# EAGLE design axios_sensor_rev1 (EAGLE 9.5.1)
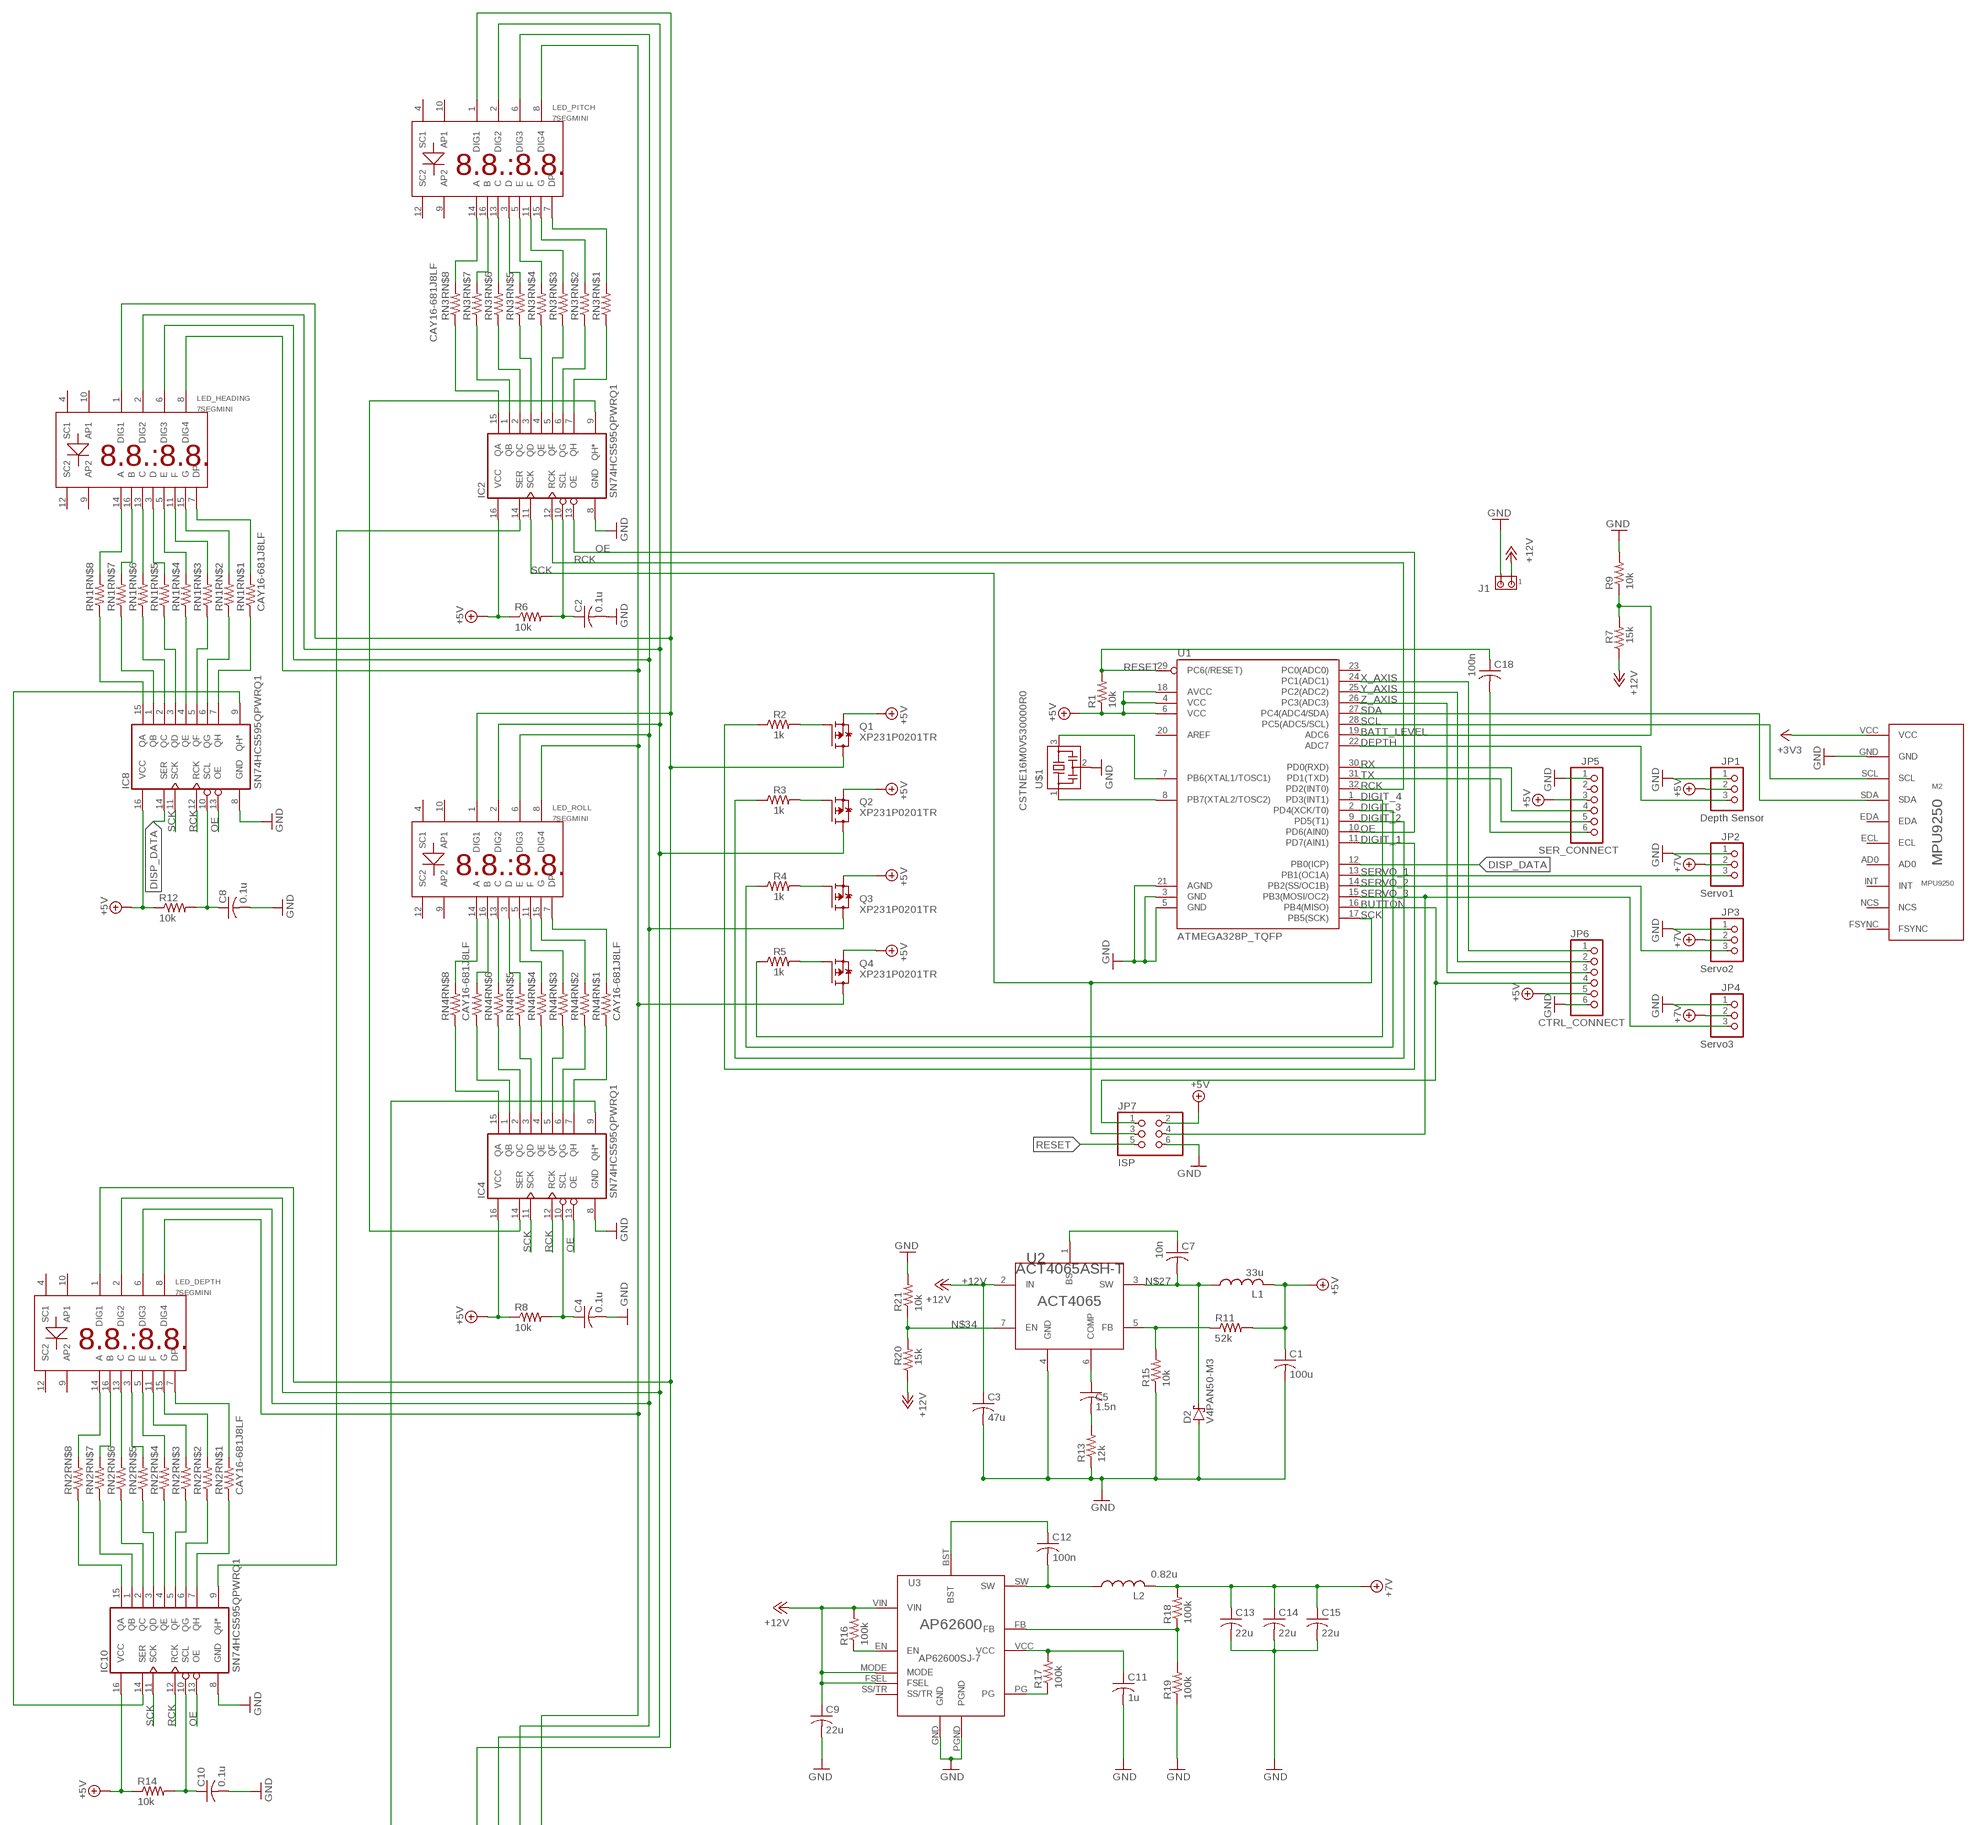
[diagram p0: schematic, sheet 1, part 1 of 2]
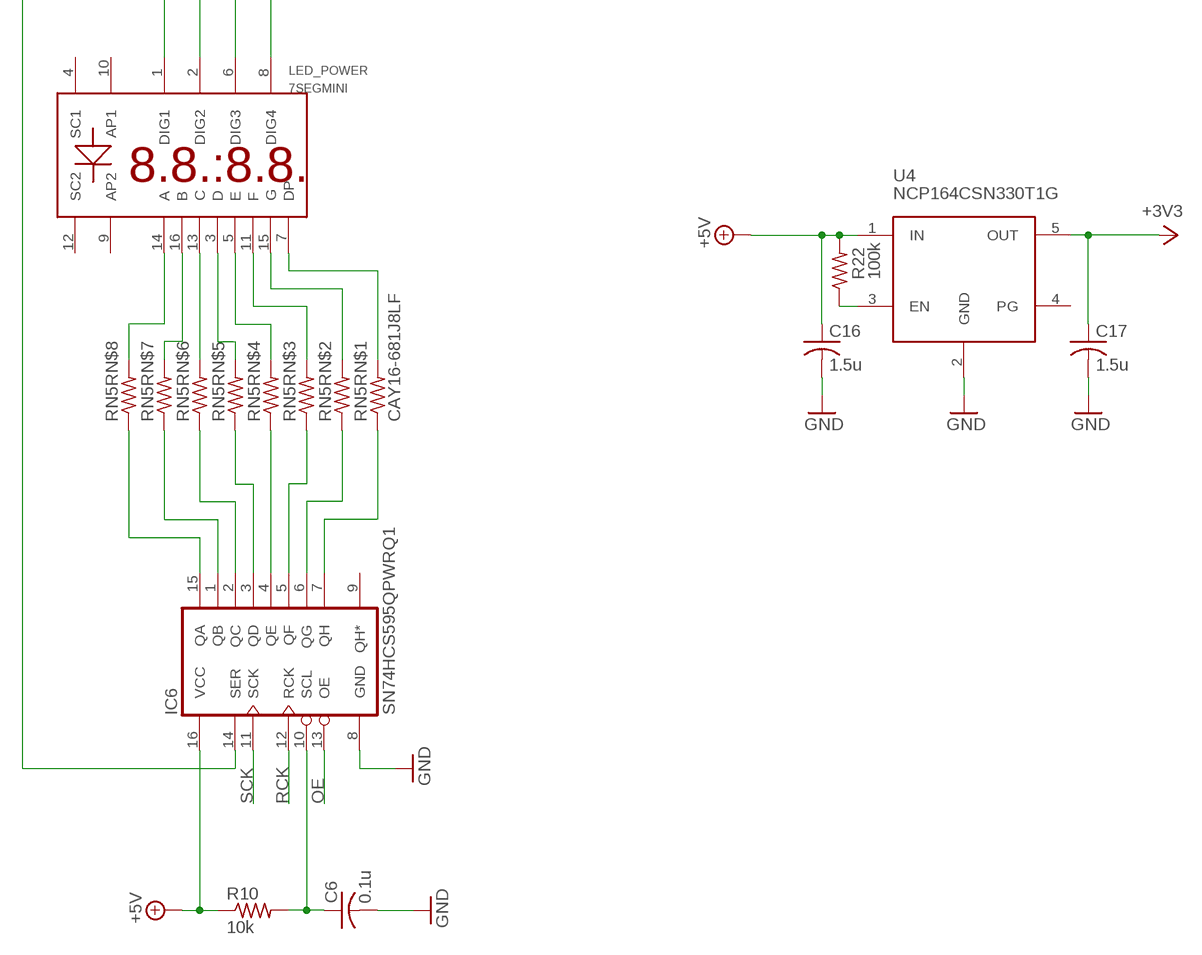
[diagram p1: schematic, sheet 1, part 2 of 2]

## Parts
C1  100u  C-USC0603  [C0603]
C2  0.1u  C-USC0603  [C0603]
C3  47u  C-USC0603  [C0603]
C4  0.1u  C-USC0603  [C0603]
C5  1.5n  C-USC0603  [C0603]
C6  0.1u  C-USC0603  [C0603]
C7  10n  C-USC0603  [C0603]
C8  0.1u  C-USC0603  [C0603]
C9  22u  C-USC0603  [C0603]
C10  0.1u  C-USC0603  [C0603]
C11  1u  C-USC0603  [C0603]
C12  100n  C-USC0603  [C0603]
C13  22u  C-USC0603  [C0603]
C14  22u  C-USC0603  [C0603]
C15  22u  C-USC0603  [C0603]
C16  1.5u  C-USC0603  [C0603]
C17  1.5u  C-USC0603  [C0603]
C18  100n  C-USC0603  [C0603]
D2  V4PAN50-M3  [SMPA]
IC2  SN74HCS595QPWRQ1  [TSSOP16]
IC4  SN74HCS595QPWRQ1  [TSSOP16]
IC6  SN74HCS595QPWRQ1  [TSSOP16]
IC8  SN74HCS595QPWRQ1  [TSSOP16]
IC10  SN74HCS595QPWRQ1  [TSSOP16]
J1  MTA02-156  [1X2MTA]
JP1  Depth Sensor  PINHD-1X3  [1X03]
JP2  Servo1  PINHD-1X3  [1X03]
JP3  Servo2  PINHD-1X3  [1X03]
JP4  Servo3  PINHD-1X3  [1X03]
JP5  SER_CONNECT  PINHD-1X6  [1X06]
JP6  CTRL_CONNECT  PINHD-1X6  [1X06]
JP7  ISP  PINHD-2X3  [2X03]
L1  33u  SRN1060-330M  [SRN1060-330M]
L2  0.82u  ECS-MPIL0630-R82MC  [ECS-MPIL0630-R82MC]
LED_DEPTH  7SEGMINI  [7SEGMINI]
LED_HEADING  7SEGMINI  [7SEGMINI]
LED_PITCH  7SEGMINI  [7SEGMINI]
LED_POWER  7SEGMINI  [7SEGMINI]
LED_ROLL  7SEGMINI  [7SEGMINI]
M2  MPU9250  [MPU9250]
Q1  XP231P0201TR  [SOT23]
Q2  XP231P0201TR  [SOT23]
Q3  XP231P0201TR  [SOT23]
Q4  XP231P0201TR  [SOT23]
R1  10k  R-US_R0603  [R0603]
R2  1k  R-US_R0603  [R0603]
R3  1k  R-US_R0603  [R0603]
R4  1k  R-US_R0603  [R0603]
R5  1k  R-US_R0603  [R0603]
R6  10k  R-US_R0603  [R0603]
R7  15k  R-US_R0603  [R0603]
R8  10k  R-US_R0603  [R0603]
R9  10k  R-US_R0603  [R0603]
R10  10k  R-US_R0603  [R0603]
R11  52k  R-US_R0603  [R0603]
R12  10k  R-US_R0603  [R0603]
R13  12k  R-US_R0603  [R0603]
R14  10k  R-US_R0603  [R0603]
R15  10k  R-US_R0603  [R0603]
R16  100k  R-US_R0603  [R0603]
R17  100k  R-US_R0603  [R0603]
R18  100k  R-US_R0603  [R0603]
R19  100k  R-US_R0603  [R0603]
R20  15k  R-US_R0603  [R0603]
R21  10k  R-US_R0603  [R0603]
R22  100k  R-US_R0603  [R0603]
RN1  CAY16-681J8LF  [CAY16-681J8LF]
RN2  CAY16-681J8LF  [CAY16-681J8LF]
RN3  CAY16-681J8LF  [CAY16-681J8LF]
RN4  CAY16-681J8LF  [CAY16-681J8LF]
RN5  CAY16-681J8LF  [CAY16-681J8LF]
U1  ATMEGA328P_TQFP  [TQFP32-08]
U2  ACT4065ASH-T  [SO8]
U3  AP62600SJ-7  [V-QFN2030-12]
U4  NCP164CSN330T1G  [TSOP-5]
U$1  CSTNE16M0V530000R0  [CSTCR6M]

## Nets
+3V3 [Low Power]: C17.1 M2.VCC U4.5(OUT)
+5V [Low Power]: C1.1 C16.1 IC2.16(VCC) IC4.16(VCC) IC6.16(VCC) IC8.16(VCC) IC10.16(VCC) JP1.2 JP5.3 JP6.5 JP7.2 L1.P$2 Q1.2(S) Q2.2(S) Q3.2(S) Q4.2(S) R1.1 R6.1 R8.1 R10.1 R11.2 R12.1 R14.1 R22.2 U1.4(VCC) U1.6(VCC) U1.18(AVCC) U4.1(IN)
+7V [Low Power]: C13.1 C14.1 C15.1 JP2.2 JP3.2 JP4.2 L2.P$2 R18.2
+12V [Low Power]: C3.1 C9.1 J1.1 R7.1 R16.2 R20.1 U2.2(IN) U3.FSEL U3.MODE U3.VIN
BATT_LEVEL [Digital]: R7.2 R9.1 U1.19(ADC6)
BUTTON: JP6.4 JP7.1 U1.16(PB4(MISO))
DEPTH [Analog]: JP1.3 U1.22(ADC7)
DIGIT_1 [Digital]: R2.1 U1.11(PD7(AIN1))
DIGIT_2 [Digital]: R3.1 U1.9(PD5(T1))
DIGIT_3 [Digital]: R4.1 U1.2(PD4(XCK/T0))
DIGIT_4 [Digital]: R5.1 U1.1(PD3(INT1))
DISP_DATA [Digital]: IC8.14(SER) U1.12(PB0(ICP))
EN7V: R16.1 U3.EN
GND [Medium Power]: C1.2 C2.2 C3.2 C4.2 C6.2 C8.2 C9.2 C10.2 C11.2 C13.2 C14.2 C15.2 C16.2 C17.2 D2.A IC2.8(GND) IC4.8(GND) IC6.8(GND) IC8.8(GND) IC10.8(GND) J1.2 JP1.1 JP2.1 JP3.1 JP4.1 JP5.1 JP6.6 JP7.6 M2.GND R9.2 R13.1 R15.1 R19.1 R21.2 U1.3(GND) U1.5(GND) U1.21(AGND) U2.4(GND) U3.GND U3.PGND U4.2(GND) U$1.2
GND1: R17.1 U3.PG
N$1 [Digital]: C18.2 JP5.6
N$5: IC8.9(QH*) IC10.14(SER)
N$7: U1.8(PB7(XTAL2/TOSC2)) U$1.1
N$12: U1.7(PB6(XTAL1/TOSC1)) U$1.3
N$17: C7.1 U2.1(BS)
N$21: Q1.1(G) R2.2
N$23: Q2.1(G) R3.2
N$24: Q3.1(G) R4.2
N$25: Q4.1(G) R5.2
N$27: C7.2 D2.C L1.P$1 U2.3(SW)
N$29: R11.1 R15.2 U2.5(FB)
N$30: R22.1 U4.3(EN)
N$31: C5.2 R13.2
N$34: R20.2 R21.1 U2.7(EN)
N$35: C5.1 U2.6(COMP)
N$36: C11.1 R17.2 U3.VCC
N$37: C12.2 L2.P$1 U3.SW
N$42: R18.1 R19.2 U3.FB
N$45: LED_PITCH.14(A) RN3.9
N$46: LED_PITCH.16(B) RN3.10
N$47: LED_PITCH.13(C) RN3.11
N$48: LED_PITCH.3(D) RN3.12
N$49: LED_PITCH.5(E) RN3.13
N$50: LED_PITCH.11(F) RN3.14
N$51: LED_PITCH.15(G) RN3.15
N$52: LED_PITCH.7(DP) RN3.16
N$53: IC2.15(QA) RN3.8
N$54: IC2.1(QB) RN3.7
N$55: IC2.2(QC) RN3.6
N$56: IC2.3(QD) RN3.5
N$57: IC2.4(QE) RN3.4
N$58: IC2.5(QF) RN3.3
N$59: IC2.6(QG) RN3.2
N$60: IC2.7(QH) RN3.1
N$61: C2.1 IC2.10(SCL) R6.2
N$62: C12.1 U3.BST
N$65: IC2.14(SER) IC10.9(QH*)
N$95: LED_ROLL.14(A) RN4.9
N$96: LED_ROLL.16(B) RN4.10
N$97: LED_ROLL.13(C) RN4.11
N$98: LED_ROLL.3(D) RN4.12
N$99: LED_ROLL.5(E) RN4.13
N$100: LED_ROLL.11(F) RN4.14
N$101: LED_ROLL.15(G) RN4.15
N$102: LED_ROLL.7(DP) RN4.16
N$103: IC4.15(QA) RN4.8
N$104: IC4.1(QB) RN4.7
N$105: IC4.2(QC) RN4.6
N$106: IC4.3(QD) RN4.5
N$107: IC4.4(QE) RN4.4
N$108: IC4.5(QF) RN4.3
N$109: IC4.6(QG) RN4.2
N$110: IC4.7(QH) RN4.1
N$111: C4.1 IC4.10(SCL) R8.2
N$115: IC2.9(QH*) IC4.14(SER)
N$145: LED_POWER.14(A) RN5.9
N$146: LED_POWER.16(B) RN5.10
N$147: LED_POWER.13(C) RN5.11
N$148: LED_POWER.3(D) RN5.12
N$149: LED_POWER.5(E) RN5.13
N$150: LED_POWER.11(F) RN5.14
N$151: LED_POWER.15(G) RN5.15
N$152: LED_POWER.7(DP) RN5.16
N$153: IC6.15(QA) RN5.8
N$154: IC6.1(QB) RN5.7
N$155: IC6.2(QC) RN5.6
N$156: IC6.3(QD) RN5.5
N$157: IC6.4(QE) RN5.4
N$158: IC6.5(QF) RN5.3
N$159: IC6.6(QG) RN5.2
N$160: IC6.7(QH) RN5.1
N$161: C6.1 IC6.10(SCL) R10.2
N$165: IC4.9(QH*) IC6.14(SER)
N$195: LED_HEADING.14(A) RN1.9
N$196: LED_HEADING.16(B) RN1.10
N$197: LED_HEADING.13(C) RN1.11
N$198: LED_HEADING.3(D) RN1.12
N$199: LED_HEADING.5(E) RN1.13
N$200: LED_HEADING.11(F) RN1.14
N$201: LED_HEADING.15(G) RN1.15
N$202: LED_HEADING.7(DP) RN1.16
N$203: IC8.15(QA) RN1.8
N$204: IC8.1(QB) RN1.7
N$205: IC8.2(QC) RN1.6
N$206: IC8.3(QD) RN1.5
N$207: IC8.4(QE) RN1.4
N$208: IC8.5(QF) RN1.3
N$209: IC8.6(QG) RN1.2
N$210: IC8.7(QH) RN1.1
N$211: C8.1 IC8.10(SCL) R12.2
N$241: LED_DEPTH.1(DIG1) LED_HEADING.1(DIG1) LED_PITCH.1(DIG1) LED_POWER.1(DIG1) LED_ROLL.1(DIG1) Q1.3(D)
N$242: LED_DEPTH.2(DIG2) LED_HEADING.2(DIG2) LED_PITCH.2(DIG2) LED_POWER.2(DIG2) LED_ROLL.2(DIG2) Q2.3(D)
N$243: LED_DEPTH.6(DIG3) LED_HEADING.6(DIG3) LED_PITCH.6(DIG3) LED_POWER.6(DIG3) LED_ROLL.6(DIG3) Q3.3(D)
N$244: LED_DEPTH.8(DIG4) LED_HEADING.8(DIG4) LED_PITCH.8(DIG4) LED_POWER.8(DIG4) LED_ROLL.8(DIG4) Q4.3(D)
N$245: LED_DEPTH.14(A) RN2.9
N$246: LED_DEPTH.16(B) RN2.10
N$247: LED_DEPTH.13(C) RN2.11
N$248: LED_DEPTH.3(D) RN2.12
N$249: LED_DEPTH.5(E) RN2.13
N$250: LED_DEPTH.11(F) RN2.14
N$251: LED_DEPTH.15(G) RN2.15
N$252: LED_DEPTH.7(DP) RN2.16
N$253: IC10.15(QA) RN2.8
N$254: IC10.1(QB) RN2.7
N$255: IC10.2(QC) RN2.6
N$256: IC10.3(QD) RN2.5
N$257: IC10.4(QE) RN2.4
N$258: IC10.5(QF) RN2.3
N$259: IC10.6(QG) RN2.2
N$260: IC10.7(QH) RN2.1
N$261: C10.1 IC10.10(SCL) R14.2
OE [Digital]: IC2.13(OE) IC4.13(OE) IC6.13(OE) IC8.13(OE) IC10.13(OE) U1.10(PD6(AIN0))
RCK [Digital]: IC2.12(RCK) IC4.12(RCK) IC6.12(RCK) IC8.12(RCK) IC10.12(RCK) U1.32(PD2(INT0))
RESET [Digital]: C18.1 JP7.5 R1.2 U1.29(PC6(/RESET))
RX: JP5.4 U1.30(PD0(RXD))
SCK [Digital]: IC2.11(SCK) IC4.11(SCK) IC6.11(SCK) IC8.11(SCK) IC10.11(SCK) JP7.3 U1.17(PB5(SCK))
SCL [Digital]: M2.SCL U1.28(PC5(ADC5/SCL))
SDA [Digital]: M2.SDA U1.27(PC4(ADC4/SDA))
SERVO_1 [Medium Power]: JP2.3 U1.13(PB1(OC1A))
SERVO_2 [Medium Power]: JP3.3 U1.14(PB2(SS/OC1B))
SERVO_3 [Medium Power]: JP4.3 JP7.4 U1.15(PB3(MOSI/OC2))
TX: JP5.5 U1.31(PD1(TXD))
X_AXIS [Digital]: JP6.1 U1.24(PC1(ADC1))
Y_AXIS [Digital]: JP6.2 U1.25(PC2(ADC2))
Z_AXIS [Digital]: JP6.3 U1.26(PC3(ADC3))
Unconnected: IC6.9(QH*) JP5.2 LED_DEPTH.4(SC1) LED_DEPTH.9(AP2) LED_DEPTH.10(AP1) LED_DEPTH.12(SC2) LED_HEADING.4(SC1) LED_HEADING.9(AP2) LED_HEADING.10(AP1) LED_HEADING.12(SC2) LED_PITCH.4(SC1) LED_PITCH.9(AP2) LED_PITCH.10(AP1) LED_PITCH.12(SC2) LED_POWER.4(SC1) LED_POWER.9(AP2) LED_POWER.10(AP1) LED_POWER.12(SC2) LED_ROLL.4(SC1) LED_ROLL.9(AP2) LED_ROLL.10(AP1) LED_ROLL.12(SC2) M2.AD0 M2.ECL M2.EDA M2.FSYNC M2.INT M2.NCS U1.20(AREF) U1.23(PC0(ADC0)) U3.SS/TR U4.4(PG)

## Library data of the parts
C1-C18 = rcl:C-US: CAPACITOR, American symbol; SPICEPREFIX: C
D2 = axios_components:V4PAN50-M3
IC2 IC4 IC6 IC8 IC10 = axios_components:SN74HCS595QPWRQ1
J1 = con-amp:MTA02-156: AMP connector
JP1-JP4 = pinhead:PINHD-1X3: PIN HEADER
JP5 JP6 = pinhead:PINHD-1X6: PIN HEADER
JP7 = pinhead:PINHD-2X3: PIN HEADER
L1 = axios_components:SRN1060-330M
L2 = axios_components:ECS-MPIL0630-R82MC
LED_DEPTH LED_HEADING LED_PITCH LED_POWER LED_ROLL = axios_components:7SEGMINI
M2 = diy-modules:MPU9250
Q1-Q4 = axios_components:XP231P0201TR: P-Channel Enhancement mode MOSFET 200 mA
R1-R22 = rcl:R-US_: RESISTOR, American symbol; SPICEPREFIX: R
RN1-RN5 = axios_components:CAY16-681J8LF
U1 = axios_components:ATMEGA328P_TQFP: Popular 328P in QFP Storefront component: ATmega328 - TQFP <https://www.sparkfun.com/products/13448> (COM-13448) Datasheet <http://www.sparkfun.com/datasheets/Components/SMD/ATMega328.pdf> SparkFun Products SparkFun RedBoard - Programmed with Arduino <https://www.sparkfun.com/products/12757> (DEV-12757) Arduino Pro Mini 328 - 5V/16MHz <https://www.sparkfun.com/products/11113> (DEV-11113) Arduino Pro Mini 328 - 3.3V/8MHz <https://www.sparkfun.com/products/11114> (DEV-11114) SparkFun OpenLog <https://www.sparkfun.com/products/13712> (DEV-13712) SparkFun MicroView - OLED Arduino Module <https://www.sparkfun.com/products/12923> (DEV-12923) SparkFun Digital Sandbox <https://www.sparkfun.com/products/12651> (DEV-12651) SparkFun PicoBoard <https://www.sparkfun.com/products/11888> (WIG-11888) Arduino Fio <https://www.sparkfun.com/products/10116> (DEV-10116) LilyPad Arduino 328 Main Board <https://www.sparkfun.com/products/13342> (DEV-13342) SparkFun RedStick <https://www.sparkfun.com/products/13741> (DEV-13741) LilyPad MP3 <https://www.sparkfun.com/products/11013> (DEV-11013) LilyPad Arduino SimpleSnap <https://www.sparkfun.com/products/10941> (DEV-10941) SparkFun Stepoko <https://www.sparkfun.com/products/13899> (ROB-13899) SparkFun Geiger Counter <https://www.sparkfun.com/products/11345> (SEN-11345) SparkFun EL Sequencer <https://www.sparkfun.com/products/12781> (COM-12781) Arduino Pro 328 - 5V/16MHz <https://www.sparkfun.com/products/10915> (DEV-10915) CryptoCape <https://www.sparkfun.com/products/12773> (DEV-12773) SparkFun IR Thermometer Evaluation Board - MLX90614 <https://www.sparkfun.com/products/10740> (SEN-10740) SparkFun RedBot Mainboard <https://www.sparkfun.com/products/12097> (ROB-12097) Arduino Pro 328 - 3.3V/8MHz <https://www.sparkfun.com/products/10914> (DEV-10914) SparkFun Block for Intel® Edison - Arduino <https://www.sparkfun.com/products/13036> (DEV-13036) SparkFun Simon Says - Surface Mount Soldering Kit <https://www.sparkfun.com/products/10935> (KIT-10935) SparkFun 7-Segment Serial Display - Red <https://www.sparkfun.com/products/11441> (COM-11441) SparkFun 7-Segment Serial Display - White <https://www.sparkfun.com/products/11629> (COM-11629) SparkFun 7-Segment Serial Display - Yellow <https://www.sparkfun.com/products/11443> (COM-11443) SparkFun 7-Segment Serial Display - Kelly Green <https://www.sparkfun.com/products/11440> (COM-11440) SparkFun 7-Segment Serial Display - Blue <https://www.sparkfun.com/products/11442> (COM-11442) SparkFun OpenSegment Serial Display - 20mm (Blue) <https://www.sparkfun.com/products/11647> (COM-11647) SparkFun OpenSegment Serial Display - 20mm (Green) <https://www.sparkfun.com/products/11646> (COM-11646) SparkFun OpenSegment Serial Display - 20mm (White) <https://www.sparkfun.com/products/11648> (COM-11648) SparkFun OpenSegment Serial Display - 20mm (Red) <https://www.sparkfun.com/products/11644> (COM-11644) SparkFun OpenSegment Serial Display - 20mm (Yellow) <https://www.sparkfun.com/products/11645> (COM-11645) SparkFun OpenSegment Shield <https://www.sparkfun.com/products/13190> (DEV-13190); PROD_ID: IC-09069
U2 = axios_components:ACT4065ASH-T
U3 = axios_components:AP62600SJ-7
U4 = axios_components:NCP164CSN330T1G
U$1 = axios_components:CSTNE16M0V530000R0

## Net classes
0 default: width 0.203 mm, drill 0.381 mm, clearance 0.203 mm
1 High Power: width 1.016 mm, drill 1.27 mm, clearance 0.203 mm
2 Low Power: width 0.254 mm, drill 0.635 mm, clearance 0.203 mm
3 Analog: width 0.254 mm, drill 0.381 mm, clearance 0.203 mm
4 Digital: width 0.203 mm, drill 0.381 mm, clearance 0.203 mm
5 Medium Power: width 0.381 mm, drill 0.635 mm, clearance 0.203 mm
6 Other: width 0.203 mm, drill 0.381 mm, clearance 0.152 mm

## Board
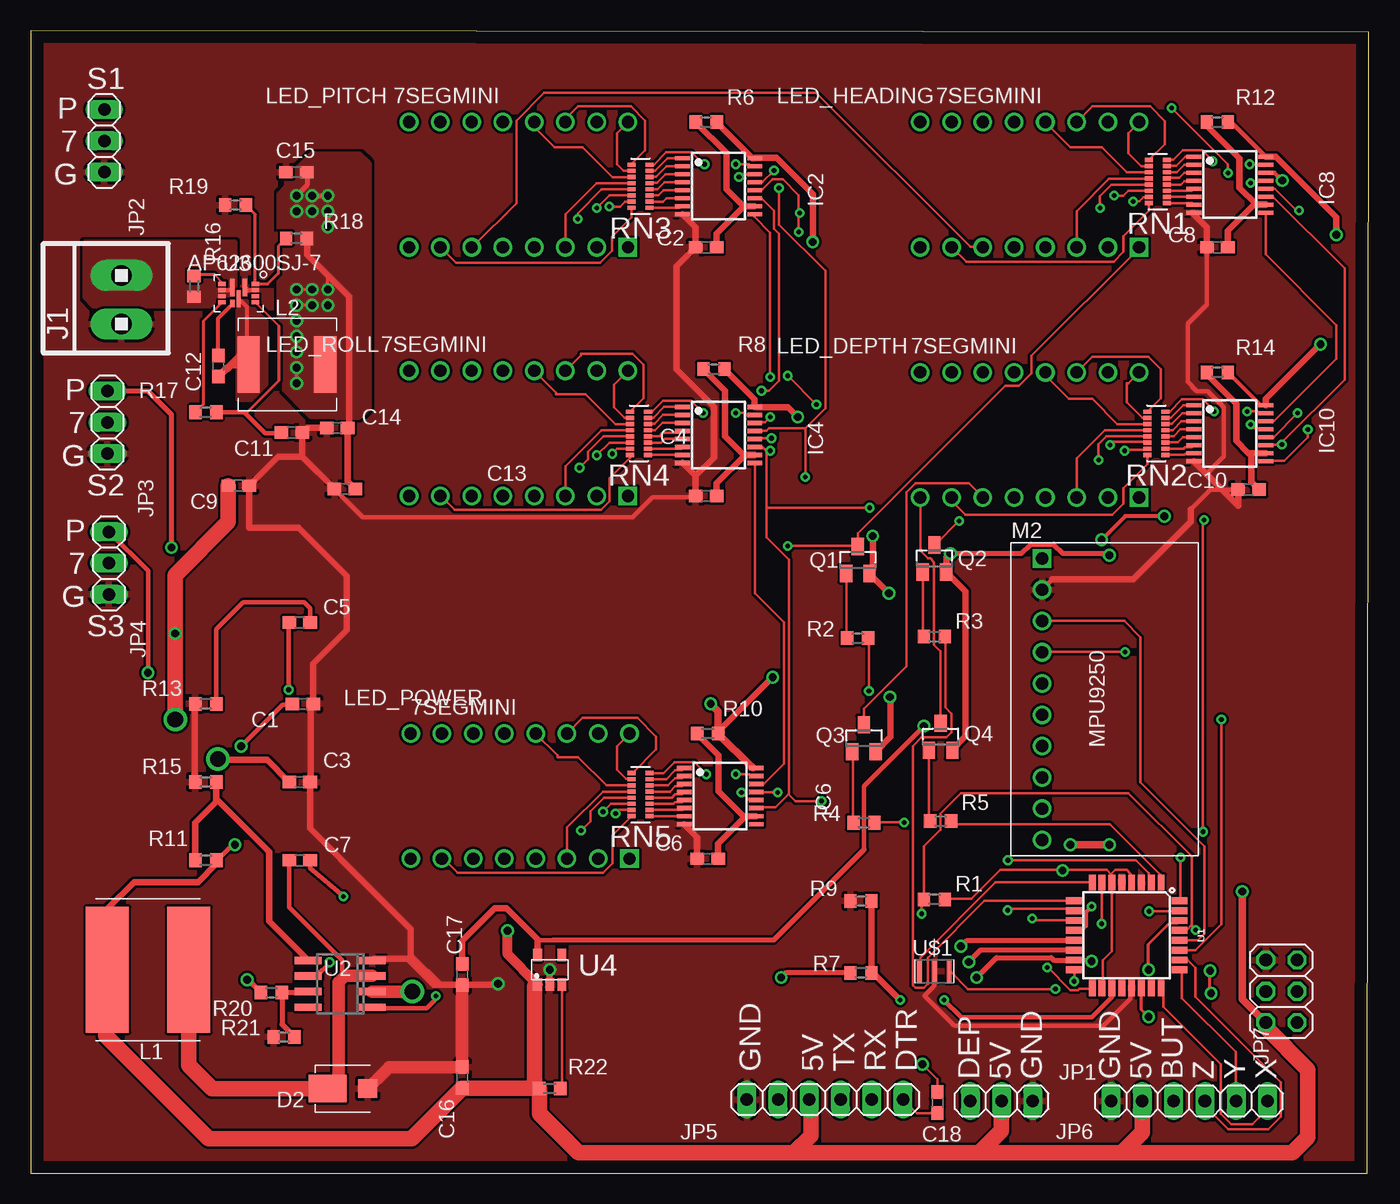
[diagram p2: board, top side]
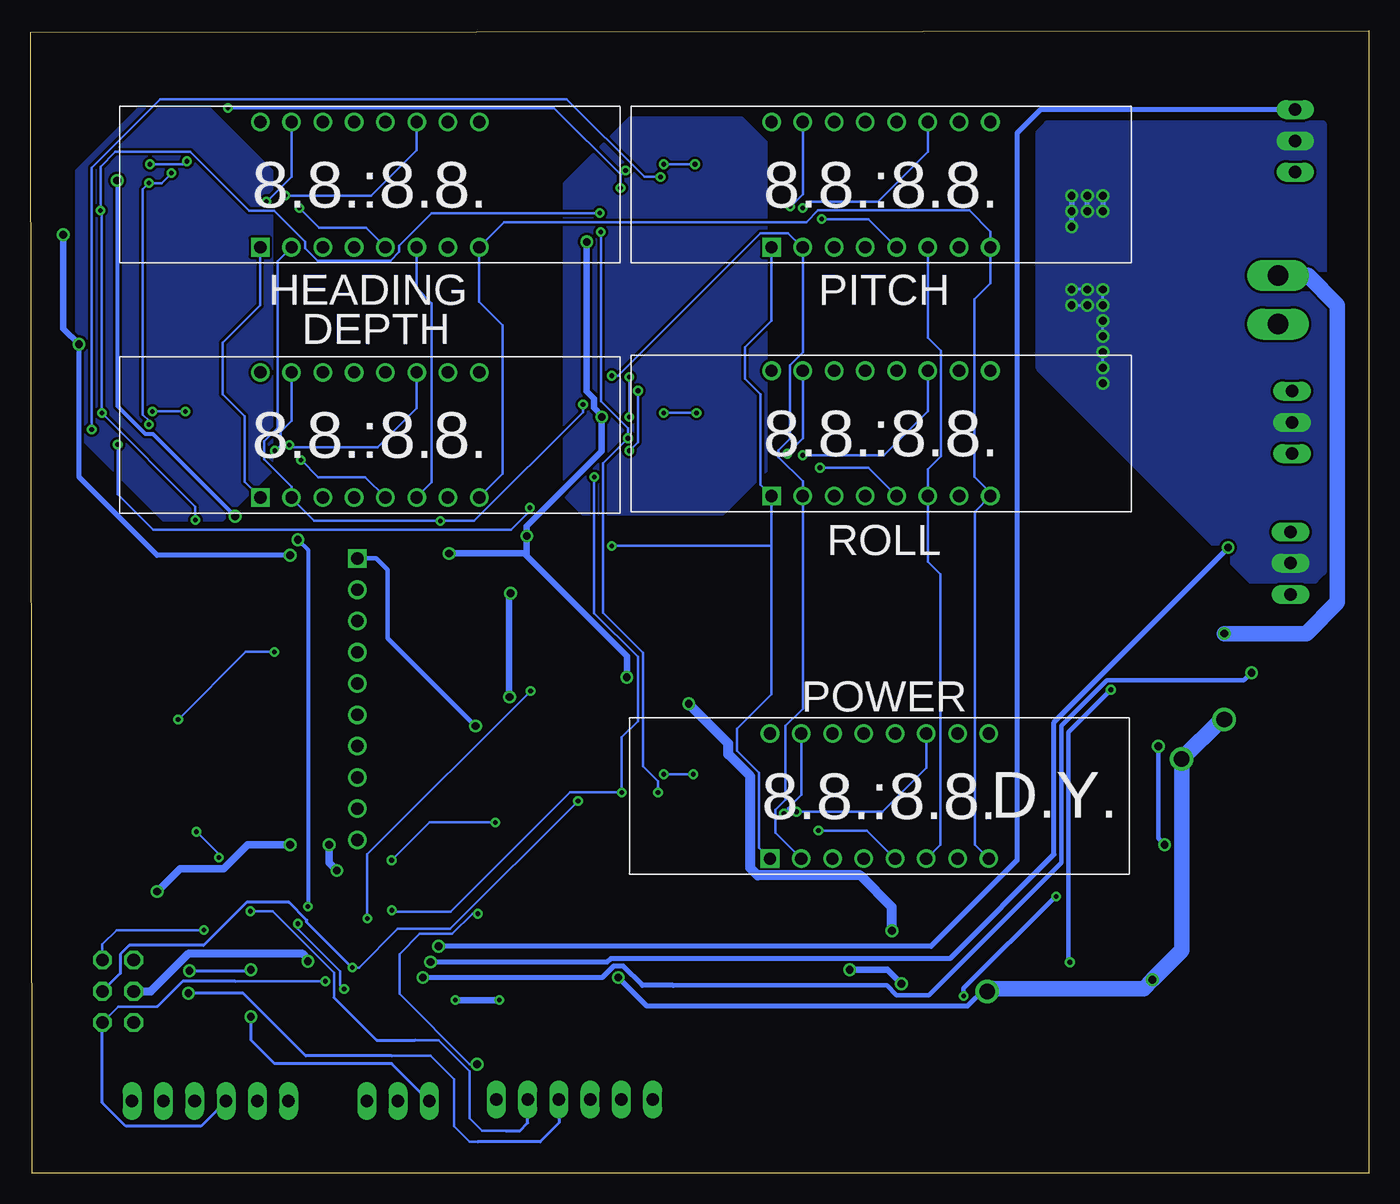
[diagram p3: board, bottom side, seen from below]

Size 108.69 x 92.76 mm. Coordinates in mm from the lower left corner, seen from the top.
Outline: 0,0 108.56,0 108.69,92.63 0,92.76 0,0
Copper layers (1*16): Top 0.035mm / dielectric 1.5mm / Bottom 0.035mm
Design rules "default": minimum track width 6mil, minimum drill 0.35mm, track to track 6mil, track to pad 6mil, pad to pad 6mil, via to via 6mil, smd to smd 6mil, copper to edge 40mil, drill to drill 6mil, minimum pad ring 10mil, minimum via ring 8mil, stop-mask expansion 4mil, vias tented up to drill 0mil, thermal gap 10mil

### Footprints (pad centres in the part's own frame; a part is rotated, then mirrored left to right if it is on the bottom)
C0603 = smd 1.1 x 1: 1 -0.85,0; 2 0.85,0
SMPA = smd 1.524 x 1.524: A 1.702,0 | smd 3.099 x 2.21: C -1.549,0
TSSOP16 = smd 0.35 x 1.2: 1 -2.275,-2.925; 2 -1.625,-2.925; 3 -0.975,-2.925; 4 -0.325,-2.925; 5 0.325,-2.925; 6 0.975,-2.925; 7 1.625,-2.925; 8 2.275,-2.925; 9 2.275,2.925; 10 1.625,2.925; 11 0.975,2.925; 12 0.325,2.925; 13 -0.325,2.925; 14 -0.975,2.925; 15 -1.625,2.925; 16 -2.275,2.925
1X2MTA = drill 1.676 long: 1 1.981,0; 2 -1.981,0
1X03 = drill 1.016 long: 1 -2.54,0; 2 0,0; 3 2.54,0
1X06 = drill 1.016 long: 1 -6.35,0; 2 -3.81,0; 3 -1.27,0; 4 1.27,0; 5 3.81,0; 6 6.35,0
2X03 = drill 1.016 octagon: 1 -2.54,-1.27; 2 -2.54,1.27; 3 0,-1.27; 4 0,1.27; 5 2.54,-1.27; 6 2.54,1.27
SRN1060-330M = smd 3.5 x 10.2: P$1 -3.3,0; P$2 3.3,0
ECS-MPIL0630-R82MC = smd 1.8 x 4.6: P$1 -3.13,0; P$2 3.1,0
7SEGMINI = drill 1 square: 1 -8.89,-5.08 | drill 1: 2 -6.35,-5.08; 3 -3.81,-5.08; 4 -1.27,-5.08; 5 1.27,-5.08; 6 3.81,-5.08; 7 6.35,-5.08; 8 8.89,-5.08; 9 8.89,5.08; 10 6.35,5.08; 11 3.81,5.08; 12 1.27,5.08; 13 -1.27,5.08; 14 -3.81,5.08; 15 -6.35,5.08; 16 -8.89,5.08
MPU9250 = drill 1: AD0 0,-3.81; ECL 0,-1.27; EDA 0,1.27; FSYNC 0,-11.43; GND 0,8.89; INT 0,-6.35; NCS 0,-8.89; SCL 0,6.35; SDA 0,3.81 | drill 1 square: VCC 0,11.43
SOT23 = smd 1 x 1.4: 1 -0.95,-1.1; 2 0.95,-1.1; 3 0,1.1
R0603 = smd 1 x 1.1: 1 -0.85,0; 2 0.85,0
CAY16-681J8LF = smd 0.35 x 0.65: 1 -1.75,-0.725; 2 -1.25,-0.725; 3 -0.75,-0.725; 4 -0.25,-0.725; 5 0.25,-0.725; 6 0.75,-0.725; 7 1.25,-0.725; 8 1.75,-0.725; 9 1.75,0.725; 10 1.25,0.725; 11 0.75,0.725; 12 0.25,0.725; 13 -0.25,0.725; 14 -0.75,0.725; 15 -1.25,0.725; 16 -1.75,0.725
TQFP32-08 = smd 1.27 x 0.559: 1 -4.293,2.8; 2 -4.293,2; 3 -4.293,1.2; 4 -4.293,0.4; 5 -4.293,-0.4; 6 -4.293,-1.2; 7 -4.293,-2; 8 -4.293,-2.8; 17 4.293,-2.8; 18 4.293,-2; 19 4.293,-1.2; 20 4.293,-0.4; 21 4.293,0.4; 22 4.293,1.2; 23 4.293,2; 24 4.293,2.8 | smd 0.559 x 1.27: 9 -2.8,-4.293; 10 -2,-4.293; 11 -1.2,-4.293; 12 -0.4,-4.293; 13 0.4,-4.293; 14 1.2,-4.293; 15 2,-4.293; 16 2.8,-4.293; 25 2.8,4.293; 26 2,4.293; 27 1.2,4.293; 28 0.4,4.293; 29 -0.4,4.293; 30 -1.2,4.293; 31 -2,4.293; 32 -2.8,4.293
SO8 = smd 0.6 x 2.2: 1 -1.905,-2.6; 2 -0.635,-2.6; 3 0.635,-2.6; 4 1.905,-2.6; 5 1.905,2.6; 6 0.635,2.6; 7 -0.635,2.6; 8 -1.905,2.6
V-QFN2030-12 = smd 0.6 x 0.35: BST 0.85,-0.5 | smd 0.35 x 0.6: EN -0.75,-1.35; FB -0.75,1.35; FSEL 0.25,-1.35; GND -0.25,1.35; MODE -0.25,-1.35; PG 0.75,-1.35; SS/TR 0.25,1.35; VCC 0.75,1.35 | smd 1.4 x 0.35: PGND -0.45,0.5; SW 0.45,0; VIN -0.45,-0.5
TSOP-5 = smd 0.7 x 1: 1 -0.99,-1.2; 2 0,-1.2; 3 0.99,-1.2; 4 0.99,1.2; 5 -0.99,1.2
CSTCR6M = smd 0.4 x 1.9: 1 -1.2,0; 2 0,0; 3 1.2,0

### Placement (x,y rotation side)
C1  22.1,38.1 0 top
C2  54.86,75.18 180 top
C3  21.84,31.75 0 top
C4  54.86,54.99 180 top
C5  21.84,44.7 0 top
C6  54.99,25.53 180 top
C7  21.84,25.4 180 top
C8  96.39,75.18 180 top
C9  16.89,55.82 0 top
C10  98.93,55.5 180 top
C11  21.21,60.13 0 top
C12  15.24,65.53 270 top
C13  25.53,55.56 180 top
C14  24.89,60.51 180 top
C15  21.59,81.28 180 top
C16  35.05,7.75 90 top
C17  35.05,16.13 270 top
C18  73.66,5.72 270 top
D2  25.65,6.86 0 top
IC2  55.88,80.14 270 top
IC4  55.88,59.94 270 top
IC6  56.01,30.61 270 top
IC8  97.41,80.26 270 top
IC10  97.41,60.07 270 top
J1  7.37,70.92 90 top
JP1  78.87,5.84 180 top
JP2  5.97,83.82 90 top
JP3  6.22,60.96 90 top
JP4  6.35,49.53 90 top
JP5  64.52,5.97 0 top
JP6  94.11,5.84 180 top
JP7  101.6,14.76 90 top
L1  9.53,16.51 180 top
L2  20.83,65.66 0 top
LED_DEPTH  81.15,59.94 0 bottom
LED_HEADING  81.15,80.26 0 bottom
LED_PITCH  39.62,80.26 0 bottom
LED_POWER  39.75,30.61 0 bottom
LED_ROLL  39.62,60.07 0 bottom
M2  82.17,38.48 0 top
Q1  67.18,49.78 0 top
Q2  73.41,49.91 0 top
Q3  67.69,35.31 0 top
Q4  73.91,35.43 0 top
R1  73.41,22.22 180 top
R2  67.18,43.43 180 top
R3  73.41,43.56 180 top
R4  67.69,28.45 180 top
R5  73.91,28.57 180 top
R6  54.86,85.34 180 top
R7  67.44,16.26 0 top
R8  55.5,65.28 180 top
R9  67.44,22.1 180 top
R10  54.99,35.69 180 top
R11  14.22,25.4 0 top
R12  96.39,85.34 180 top
R13  14.22,38.1 0 top
R14  96.39,65.02 180 top
R15  14.22,31.75 0 top
R16  13.27,72.01 270 top
R17  14.22,61.78 0 top
R18  21.59,75.9 0 top
R19  16.63,78.61 0 top
R20  19.56,14.65 0 top
R21  20.57,11.05 180 top
R22  42.16,6.86 180 top
RN1  91.57,80.52 90 top
RN2  91.44,60.07 90 top
RN3  49.53,80.14 90 top
RN4  49.4,60.07 90 top
RN5  49.53,30.73 90 top
U1  89.03,19.3 270 top
U2  25.15,15.37 90 top
U3  16.89,71.46 270 top
U4  42.16,16.51 0 top
U$1  73.41,16.38 0 top

### Tracks (layer width: path | path; a pad name or v marks a point on that pad's centre or on a via)
+3V3  (via drill 0.64)
  Top 0.381: v72.57,36.3 67.69,31.42 67.69,26.26 | 42.42,18.92 41.23,18.92 41.17,18.98
  Top 0.406: 67.69,26.26 60.35,18.92 42.42,18.92
  Top 0.508: C17.1 35.05,18.88 37.69,21.52 38.63,21.52 41.17,18.98 U4.5
  Bottom 0.381: M2.VCC 80.62,49.91 79.7,49 79.7,43.43 v72.57,36.3
+5V  (via drill 0.64, 0.64 pad 0.38)
  Top 0.203: 87.76,24.26 87.81,24.21 87.81,23.6 | 87.76,24.26 87.4,24.61 83.82,24.61 78.77,24.61 76.43,22.28 74.3,22.28 R1.1 | 87.81,23.6 87.81,18.01 87.1,17.3 87.1,15.06 U1.18 | 87.81,23.6 U1.6 | 87.76,24.26 88.11,24.61 89.03,24.61 89.33,24.31 89.33,23.6 U1.4
  Top 0.254: L1.P$2 6.23,21.46 | 15.07,25.11 R11.2 15.16,25.43 | 74.91,34.37 Q4.2 | 74.4,48.79 Q2.2 74.4,48.9 | 68.4,49 68.2,48.79 Q1.2 | 59.05,62.2 IC4.16 | 21.16,38.02 C1.1 | IC6.16 58.72,32.88 58.67,32.93
  Top 0.305: R14.1 99.92,62.35 IC10.16
  Top 0.381: IC8.16 97.53,85.34 R12.1 | 74.91,34.42 74.91,34.37 | 21.16,38.02 20.45,38.02 v17.09,34.67 | v16.59,26.67 16.41,26.67 15.16,25.43
  Top 0.406: v87.63,50.17 87.48,50.32 83.84,50.32 83.09,51.07 81.25,51.07 80.49,50.32 v74.7,50.32 | R10.1 55.84,35.83 56.05,36.03
  Top 0.508: R6.1 58.65,82.41 IC2.16 58.84,82.45 60.58,82.45 63.53,79.5 v63.53,75.62 | IC4.16 58.8,62.82 R8.1 | 41.27,6.9 R22.2 40.93,7.24 | U4.1 41.07,15.31 40.93,15.17 | 15.07,25.11 13.59,23.62 8.38,23.62 6.23,21.46 | 74.91,34.42 75.95,35.46 75.95,47.24 74.4,48.79 | Q1.2 v69.72,47.09 | 59.05,62.2 61.49,62.2 v62.31,61.39 | 68.4,49 v68.4,51.74 | v60.27,40.26 56.05,36.03 | 74.4,48.9 74.4,50.01 v74.7,50.32 | v69.8,38.66 69.85,38.61 69.85,35.42 Q3.2 | IC8.16 100.35,82.52 101.12,82.52 106.05,77.6 v106.05,76.2 | v104.78,67.31 100.33,62.87 IC10.16
  Top 0.61: 58.67,32.93 58.6,33 58.53,33 R10.1 55.84,37.5 v55.24,38.1 | JP7.2 98.42,14.12 v98.42,22.86 | v87.63,26.67 v84.45,26.67 | v83.82,24.57 83.82,24.61
  Top 0.813: U4.1 38.73,17.75 v38.73,19.68
  Top 1.27: L1.P$2 6.1,16.51 6.1,11.14 14.45,2.79 30.95,2.79 C16.1 41.27,6.9 | 40.93,15.17 40.93,7.24 | R22.2 41.31,4.83 44.49,1.65 61.98,1.65 | 61.98,1.65 63.37,3.05 63.37,5.84 JP5.3 | JP1.2 78.87,3.45 77.07,1.65 | 77.07,1.65 61.98,1.65 | 77.07,1.65 88.65,1.65 | JP6.5 90.3,3.3 88.65,1.65 | JP7.2 100.33,11.82 103.76,8.39 103.76,2.91 102.5,1.65 88.65,1.65
  Bottom 0.254: 68.4,50.32 68.4,50.11 | 62.31,61.49 v62.31,61.39
  Bottom 0.381: v17.09,34.67 17.09,27.18 v16.59,26.67
  Bottom 0.406: v87.63,50.17 98.42,50.17 104.78,56.52 v104.78,67.31
  Bottom 0.508: v62.31,61.39 62.31,58.62 68.4,52.53 v68.4,51.74 68.4,50.32 v74.7,50.32 | v60.27,40.26 60.27,41.99 68.4,50.11 | v63.53,75.62 63.53,63.48 62.94,62.89 62.94,62.13 62.31,61.49 | v69.8,38.66 69.85,38.71 69.85,46.97 v69.72,47.09 | v106.05,76.2 106.05,68.58 v104.78,67.31
  Bottom 0.61: v98.42,22.86 96.56,24.73 93.02,24.73 91.08,26.67 v87.63,26.67 | v84.45,26.67 84.45,25.21 v83.82,24.57
  Bottom 0.813: v38.73,19.68 38.73,21.59 41.31,24.16 49.65,24.16 50.24,24.76 50.24,32.22 52.02,34 52.02,34.87 v55.24,38.1
+7V  (via drill 0.64)
  Top 0.254: L2.P$2 23.93,63.93 | v21.59,64.14 v21.59,65.41 | v21.59,66.67 v21.59,67.95 | v22.86,70.48 v21.59,70.48 | v21.59,71.76 v22.86,71.76 | v24.13,71.76 24.13,72.9 24.07,72.96
  Top 0.406: C15.1 22.44,80.23 v21.59,79.38 | v22.86,79.38 v24.13,79.38 | v24.13,78.11 v24.13,76.84
  Top 0.508: R18.2 22.44,74.59 24.07,72.96 25.87,71.16 25.87,60.64 C14.1 25.74,56.2 C13.1
  Bottom 0.254: v21.59,65.41 v21.59,66.67 | v21.59,67.95 v21.59,69.22 | v24.13,70.48 v22.86,70.48 | v21.59,70.48 v21.59,71.76 | v22.86,71.76 v24.13,71.76
  Bottom 0.406: v21.59,79.38 v21.59,78.11 | v22.86,78.11 v22.86,79.38 | v24.13,78.11 v24.13,79.38 v24.13,76.84
  pour Bottom (no thermals): 3.81,85.09 3.81,48.9 4.44,48.26 9.53,48.26 13.97,52.71 26.67,65.41 26.67,84.45 26.04,85.09
  pour Top (no thermals): 20.95,80.01 20.32,79.38 20.32,64.14 22.86,61.59 26.67,61.59 27.3,62.23 27.3,81.92 26.67,82.55 22.86,82.55 20.95,80.64
+12V  (via drill 0.64, 1.27, 1.27 pad 1.27)
  Top 0.254: v15.19,33.63 15.27,33.55
  Top 0.381: U3.MODE 16.18,71.71 16.25,71.78 16.26,71.78 U3.VIN
  Top 0.406: R20.1 17.67,15.68 v17.59,15.68 | R7.1 61.34,16.26 v60.96,15.88
  Top 0.508: 15.27,33.55 19.19,33.55 C3.1
  Top 1.016: U2.2 v30.99,14.73
  Top 1.27: C9.1 16.04,52.87 11.74,48.57 v11.74,43.82 v11.74,36.83
  Bottom 0.254: 30.58,14.99 v30.99,14.73
  Bottom 0.406: 30.58,14.99 31.18,14.99 32.59,13.58 58.66,13.58 v60.96,15.88
  Bottom 1.27: 30.58,14.99 18.29,14.99 v17.59,15.68 15.16,18.11 15.16,33.6 v15.19,33.63 11.99,36.83 v11.74,36.83 | J1.1 4.95,72.9 2.54,70.48 2.54,46.36 5.08,43.82 v11.74,43.82
  pour Top (rank 2, no thermals): 4.44,75.56 4.44,71.12 5.08,70.48 15.88,70.48 16.51,71.12 16.51,75.56
BATT_LEVEL  (via drill 0.38)
  Top 0.203: 68.3,16.28 R7.2 68.4,16.28 | 68.3,22.07 R9.1 | 87.81,14.96 U1.19
  Top 0.381: 87.81,14.96 87.81,14.27 86.18,12.65 75.59,12.65 v74.19,14.05
  Top 0.508: 68.3,22.07 68.3,16.28 | 68.4,16.28 v70.64,14.05
  Bottom 0.508: v70.64,14.05 v74.19,14.05
BUTTON  (via drill 0.38)
  Top 0.203: v84.76,15.57 84.76,16.48 U1.16
  Bottom 0.203: v84.76,15.57 92.08,15.57 | 98.42,13.51 101.58,13.51 JP7.1
  Bottom 0.254: JP6.4 94.87,3.81 100.97,3.81 102.87,5.72 JP7.1 | 92.08,15.57 96.37,15.57 98.42,13.51
DEPTH  (via drill 0.64)
  Top 0.254: v90.8,12.7 90.23,13.28 U1.22
  Bottom 0.254: JP1.3 79.38,8.89 88.9,8.89 90.8,10.8 v90.8,12.7
DIGIT_1  (via drill 0.38)
  Top 0.203: v68.1,39.14 68.1,43.41 R2.1 | v81.36,20.68 81.48,20.55 84.66,20.55 U1.11
  Bottom 0.203: v68.1,39.14 81.36,25.88 v81.36,20.68
DIGIT_2
  Top 0.203: R3.1 74.3,43.51 74.3,37.82 74.8,37.31 74.8,35.79 74.4,35.38 72.36,35.38 71.65,34.67 71.65,15.27 71.86,15.06 72.57,15.06 72.87,15.37 72.87,17.5 77.48,22.1 U1.9
DIGIT_3  (via drill 0.38)
  Top 0.203: v70.94,28.47 68.61,28.47 R4.1 | U1.2 90.81,23.81 90.81,24.36 89.77,25.4 v79.38,25.4
  Bottom 0.203: v79.38,25.4 76.3,28.47 v70.94,28.47
DIGIT_4
  Top 0.203: R5.1 75.02,28.32 87.66,28.32 91.77,24.21 91.77,23.6 U1.1
DISP_DATA  (via drill 0.38, 0.64)
  Top 0.305: IC8.14 101.02,81.24 v101.66,80.6 | v92.08,53.34 88.91,53.34 v87,51.42 | v86.17,21.63 85.72,21.19 85.72,20.08 85.35,19.7 U1.12
  Bottom 0.305: v92.08,53.34 98.77,60.03 99.4,60.03 101.66,62.3 v101.66,80.6 | v87,51.42 86.17,50.6 v86.17,21.63
EN7V
  Top 0.203: U3.EN 15.57,72.26 14.95,72.93
  Top 0.254: R16.1 13.34,72.93 14.95,72.93
GND  (via drill 0.64)
  Top 0.381: 22.73,31.79 C3.2 | C8.2 95.54,70.52 93.98,68.96 93.98,64.26 94.74,63.5 95.63,63.5 96.93,62.2 96.93,58.19 95.54,56.81 95.54,56.74 | 83.01,48.21 M2.GND | C10.2 95.81,55.5 94.23,53.92 | C4.2 53.77,54.89 50.52,54.89 48.89,53.26 26.95,53.26 24.82,55.4 C13.2 | U$1.2 73.38,16.38 73.38,15.16 72.61,14.39 75.03,11.96 87.15,11.96 89.33,14.15 89.33,14.86 U1.21 | U3.GND 17.59,71.71 U3.PGND
  Top 0.508: IC8.8 94.47,77.98 94.36,77.98 95.54,76.8 C8.2 | IC2.8 54.01,76.8 C2.2 52.45,73.62 52.45,65.28 55.5,62.23 55.5,58.1 54.01,56.61 | IC4.8 54.01,56.61 | 54.01,56.61 C4.2 | IC10.8 95.54,56.74 98.08,54.2 C10.2 | IC6.8 54.14,27.27 C6.2 | 33.23,15.28 30.86,17.65 30.86,19.8 25.21,25.46 25.21,25.49 22.69,28 C3.2 | 33.23,15.28 C17.2 37.88,15.28 v37.97,15.37 | v42.16,16.51 U4.2 | C13.2 22.06,58.18 | 22.06,58.18 C11.2 22.44,60.52 C14.2 | R15.1 13.32,31.8 13.32,38.05 R13.1 | 22.06,58.18 20.11,58.18 C9.2 17.74,52.41 21.76,52.41 25.65,48.51 25.65,44.07 22.95,41.36 C1.2 22.73,37.85 22.73,31.79 | U2.4 27.87,17.4 30.61,17.4 32.73,15.28 33.23,15.28 | 83.01,48.21 89.56,48.21 94.23,52.88 94.23,53.92
  Top 1.016: D2.A 29.09,8.6 C16.2 C17.2
  Bottom 0.508: v37.97,15.37 39.12,16.51 v42.16,16.51
  pour Bottom: 50.93,85.73 60.07,85.73 65.41,80.39 65.41,54.99 63.88,53.47 52.45,53.47 48.89,57.02 48.89,83.69
  pour Bottom: 89.03,81.41 94.11,86.49 99.95,86.49 105.03,81.41 105.03,60.07 97.92,52.96 93.09,52.96 89.03,57.02
  pour Top (rank 6): -0.64,93.34 -0.64,-0.63 109.22,-0.63 109.22,93.34
GND1
  Top 0.254: U3.PG 14.02,69.19 14.02,62.43 R17.1
N$1
  Top 0.203: C18.2 71.97,4.86 JP5.6
N$5
  Top 0.203: IC8.9 100.33,74.6 106.07,68.86 106.07,66.14 101.02,61.09 100.41,61.09 IC10.14
N$7
  Top 0.203: U1.8 78.36,23.6 72.26,17.5 72.26,16.38 U$1.1
N$12  (via drill 0.38)
  Top 0.203: v87,20.24 87,23.6 U1.7 | v83.24,14.93 76.15,14.93 74.7,16.38 U$1.3
  Bottom 0.203: v87,20.24 87,19.84 83.54,16.38 83.54,15.24 v83.24,14.93
N$17  (via drill 0.38)
  Top 0.203: v25.4,22.45 v25.4,22.46
  Top 0.381: v32.92,14.38 32.92,14.15 32.16,13.39 27.82,13.39 U2.1 | v25.4,22.46 22.69,24.76 C7.1
  Bottom 0.381: v25.4,22.45 25.48,22.45 32.92,15.01 v32.92,14.38
N$21
  Top 0.203: R2.2 66.27,43.51 66.27,48.59 Q1.1
N$23
  Top 0.203: R3.2 72.47,43.61 72.47,48.79 Q2.1
N$24
  Top 0.203: R4.2 66.78,28.47 66.78,34.16 Q3.1
N$25
  Top 0.203: R5.2 72.97,28.57 72.97,34.27 Q4.1
N$27
  Top 0.381: C7.2 20.99,21.58 25.3,17.27 25.3,16.41 25.53,16
  Top 1.016: U2.3 25.53,16 25.02,15.49 25.02,7.77 D2.C
  Top 1.27: D2.C 14.73,6.86 12.83,8.77 L1.P$1
N$29
  Top 0.508: R11.1 13.37,28.44 15.07,30.14 15.07,30.4 | 15.07,30.4 19.38,26.1 19.38,20.44 U2.5 | 15.07,30.4 R15.2
N$30
  Top 0.203: U4.3 43.15,7 R22.1
N$31
  Top 0.381: R13.2 15.07,44.16 17.27,46.36 22.22,46.36 22.69,45.89 C5.2
N$34
  Top 0.406: U2.7 22.46,14.65 R20.2 20.41,12.07 R21.1
N$35  (via drill 0.38)
  Top 0.203: U2.6 23.24,16 | 20.95,44.63 C5.1
  Top 0.381: v20.95,39.24 20.95,44.63 | v24.28,17.12 24.28,17.04 23.24,16
  Bottom 0.203: v24.28,17.12 24.38,17.22
  Bottom 0.381: v20.95,39.24 24.38,35.81 24.38,17.22
N$36
  Top 0.203: U3.VCC 20.15,68.81
  Top 0.254: R17.2 17.59,61.78 20.15,64.34 20.15,68.81
  Top 0.381: R17.2 17.34,61.78 19.05,60.07 20.29,60.07 C11.1
N$37
  Top 0.305: U3.SW 17.55,70.35 17.55,66.93
  Top 0.61: C12.2 15.88,65.32 15.95,65.32 16.29,65.66 | 16.29,65.66 L2.P$1 | 16.29,65.66 17.55,66.93
  pour Top (no thermals): 16.89,71.76 16.89,62.87 19.05,62.87 19.05,69.85 18.41,69.85 17.14,71.12 17.14,71.76
N$42
  Top 0.254: R19.2 18.24,77.86 U3.FB 19.25,72.21 20.11,73.06 20.11,75.27 R18.1
N$45
  Top 0.203: LED_PITCH.14 43.43,85.6 44.45,86.61 48.77,86.61 49.91,85.47 49.91,83.06 48.8,81.95 RN3.9
N$46
  Top 0.203: LED_PITCH.16 47.62,84.45 47.62,81.92 48.15,81.39 RN3.10
N$47
  Top 0.203: LED_PITCH.13 40.89,84.96 42.55,83.31 44.83,83.31 47.26,80.89 RN3.11
N$48
  Top 0.203: LED_PITCH.3 43.43,77.85 45.97,80.39 RN3.12
N$49  (via drill 0.38)
  Top 0.203: v44.45,77.47 44.45,77.95 46.39,79.89 RN3.13
  Bottom 0.203: LED_PITCH.5 40.64,77.47 v44.45,77.47
N$50  (via drill 0.38)
  Top 0.203: RN3.14 47,79.39 v45.97,78.36
  Bottom 0.203: LED_PITCH.11 35.81,82.93 39.88,78.87 45.47,78.87 v45.97,78.36
N$51  (via drill 0.38)
  Top 0.203: v46.99,78.49 47.88,78.49 48.28,78.89 RN3.15
  Bottom 0.203: LED_PITCH.15 45.97,79.5 v46.99,78.49
N$52
  Top 0.203: LED_PITCH.7 34.54,73.91 46.23,73.91 47.2,74.89 47.2,76.03 48.8,77.63 RN3.16
N$53  (via drill 0.38)
  Top 0.203: RN3.8 50.61,81.89 51.62,82.89 53.68,82.89 54.66,81.92 v54.74,81.92 | v57.28,81.92 58.35,81.92 58.41,81.85 58.71,81.85 IC2.15
  Bottom 0.203: v54.74,81.92 v57.28,81.92
N$54
  Top 0.203: RN3.7 50.27,81.41 50.71,81.41 51.71,82.41 IC2.1
N$55
  Top 0.203: RN3.6 50.27,80.91 50.78,80.91 51.64,81.76 IC2.2
N$56
  Top 0.203: RN3.5 50.27,80.41 50.86,80.41 51.56,81.11 IC2.3
N$57
  Top 0.203: RN3.4 50.27,79.91 50.93,79.91 51.48,80.46 IC2.4
N$58
  Top 0.203: RN3.3 50.27,79.41 51,79.41 51.41,79.81 IC2.5
N$59
  Top 0.203: RN3.2 51.36,78.89 51.64,79.16 IC2.6
N$60
  Top 0.203: RN3.1 52.69,78.39 52.72,78.42 52.86,78.42 IC2.7
N$61
  Top 0.508: R6.2 56.52,82.84 56.52,79.88 57.89,78.51 IC2.10 57.94,78.51 55.71,76.29 C2.1
N$62
  Top 0.203: U3.BST 16.08,70.3 16.08,70.28
  Top 0.305: C12.1 15.24,69.43 16.08,70.28
N$65  (via drill 0.38)
  Top 0.203: v57.53,80.9 57.73,81.1 58.75,81.1 IC2.14 | v103.73,60.38 103.73,59.74 101.83,57.84 100.41,57.84 IC10.9
  Bottom 0.203: v57.53,80.9 58.85,80.9 65.15,87.2 98.17,87.2 103.73,81.64 v103.73,60.38
N$95
  Top 0.203: LED_ROLL.14 44.7,66.42 44.7,66.55 48.89,66.55 49.78,65.66 49.78,62.93 RN4.9
N$96
  Top 0.203: LED_ROLL.16 47.37,64.01 47.37,62.2 48.25,61.32 RN4.10
N$97
  Top 0.203: LED_ROLL.13 42.67,63.37 42.67,63.25 45.09,63.25 47.51,60.82 RN4.11
N$98
  Top 0.203: LED_ROLL.3 43.43,57.4 46.35,60.32 RN4.12
N$99  (via drill 0.38)
  Top 0.203: v44.58,57.28 45.28,57.98 45.28,58.58 46.51,59.82 RN4.13
  Bottom 0.203: LED_ROLL.5 40.64,57.28 v44.58,57.28
N$100  (via drill 0.38)
  Top 0.203: v45.97,58.29 47,59.32 RN4.14
  Bottom 0.203: LED_ROLL.11 35.81,61.85 39.37,58.29 v45.97,58.29
N$101  (via drill 0.38)
  Top 0.203: v47.24,58.42 47.64,58.82 RN4.15
  Bottom 0.203: LED_ROLL.15 45.97,59.69 v47.24,58.42
N$102
  Top 0.203: LED_ROLL.7 34.42,53.85 46.33,53.85 47.03,54.55 47.03,56.43 48.68,58.08 RN4.16
N$103  (via drill 0.38)
  Top 0.203: RN4.8 50.48,61.82 51.36,62.7 53.63,62.7 v54.61,61.72 | IC4.15 58.77,61.53 58.23,61.53 58.04,61.72 v57.28,61.72
  Bottom 0.203: v57.28,61.72 v54.61,61.72
N$104
  Top 0.203: RN4.7 50.15,61.34 50.58,61.34 51.46,62.22 IC4.1
N$105
  Top 0.203: RN4.6 50.15,60.84 50.65,60.84 51.38,61.57 IC4.2
N$106
  Top 0.203: RN4.5 50.15,60.34 50.73,60.34 51.31,60.92 IC4.3
N$107
  Top 0.203: IC4.4 52.78,60.1 51.34,60.1 51.06,59.82 RN4.4
N$108
  Top 0.203: RN4.3 51.21,59.32 51.51,59.62 IC4.5
N$109
  Top 0.203: RN4.2 52.81,58.82 IC4.6
N$110
  Top 0.203: RN4.1 IC4.7
N$111
  Top 0.508: R8.2 56.39,63.54 56.39,59.82 57.89,58.32 IC4.10 58.79,58.3 58.02,58.3 55.71,56 C4.1
N$115  (via drill 0.38)
  Top 0.203: v60.07,61.39 59.66,60.98 58.85,60.98 IC4.14 | v60.07,64.64 60.07,76.38 58.8,77.64 IC2.9
  Bottom 0.203: v60.07,64.64 v60.07,61.39
N$145
  Top 0.203: LED_POWER.14 44.83,36.96 49.28,36.96 50.8,35.43 50.8,34.42 48.87,32.48 RN5.9
N$146
  Top 0.203: RN5.10 48.78,32 48.35,32 47.62,32.73 47.62,34.67 LED_POWER.16
N$147
  Top 0.203: LED_POWER.13 42.8,33.91 42.8,33.78 44.48,33.78 46.75,31.5 48.78,31.5 RN5.11
N$148
  Top 0.203: LED_POWER.3 43.56,28.07 46.48,30.98 RN5.12
N$149  (via drill 0.38)
  Top 0.203: v44.7,27.81 45.47,28.57 45.47,29.4 46.55,30.48 RN5.13
  Bottom 0.203: LED_POWER.5 40.77,27.81 v44.7,27.81
N$150  (via drill 0.38)
  Top 0.203: v46.48,29.34 47.13,29.98 RN5.14
  Bottom 0.203: LED_POWER.11 35.94,32.89 39.5,29.34 v46.48,29.34
N$151  (via drill 0.38)
  Top 0.203: v47.5,29.21 47.78,29.49 48.79,29.49 RN5.15
  Bottom 0.203: v47.5,29.21 47.18,29.53 47.18,29.63 46.1,30.71 LED_POWER.15
N$152
  Top 0.203: LED_POWER.7 33.53,25.53 34.67,24.38 46.48,24.38 47.24,25.15 47.24,27.42 RN5.16
N$153  (via drill 0.38)
  Top 0.203: RN5.8 51.41,32.48 52.28,33.36 53.94,33.36 54.86,32.43 v54.86,32.39 | v57.28,32.39 58.35,32.39 58.41,32.32 58.84,32.32 IC6.15
  Bottom 0.203: v57.28,32.39 v54.86,32.39
N$154
  Top 0.203: IC6.1 52.91,32.71 52.36,32.71 51.63,31.98 RN5.7
N$155
  Top 0.203: IC6.2 52.91,32.06 52.36,32.06 51.78,31.48 RN5.6
N$156
  Top 0.203: IC6.3 52.91,31.41 52.36,31.41 51.93,30.98 RN5.5
N$157
  Top 0.203: IC6.4 52.91,30.76 52.36,30.76 52.08,30.48 RN5.4
N$158
  Top 0.203: RN5.3 52.23,29.98 52.36,30.11 52.91,30.11 IC6.5
N$159
  Top 0.203: RN5.2 52.93,29.48 IC6.6
N$160
  Top 0.203: RN5.1 IC6.7
N$161
  Top 0.508: R10.2 55.88,33.95 55.88,30.99 57.89,28.98 IC6.10 58.06,28.98 55.84,26.76 C6.1
N$165
  Top 0.203: IC4.9 58.85,57.63 58.85,47.07 61.19,44.73 61.19,33.25 59.56,31.62 58.95,31.62 IC6.14
N$195
  Top 0.203: RN1.9 92.12,83.54 92.12,85.43 90.93,86.61 86.23,86.61 LED_HEADING.14
N$196
  Top 0.203: RN1.10 90.21,81.77 89.15,82.82 89.15,84.45 LED_HEADING.16
N$197
  Top 0.203: RN1.11 89.04,81.27 87,83.31 84.45,83.31 LED_HEADING.13
N$198
  Top 0.203: RN1.12 90.82,80.75 87.6,80.75 84.96,78.11 LED_HEADING.3
N$199  (via drill 0.38)
  Top 0.203: v86.87,78.36 86.87,79.34 87.79,80.27 RN1.13
  Bottom 0.203: v86.87,78.36 85.26,76.75 81.45,76.75 LED_HEADING.5
N$200  (via drill 0.38)
  Top 0.203: RN1.14 89.17,79.77 88.77,79.38 v88.01,79.38
  Bottom 0.203: LED_HEADING.11 77.34,83.06 81.03,79.38 v88.01,79.38
N$201  (via drill 0.38)
  Top 0.203: RN1.15 90.82,79.25 90.39,79.25 90.04,78.9 v89.54,78.9
  Bottom 0.203: LED_HEADING.15 87.5,80.9 89.5,78.9 v89.54,78.9
N$202
  Top 0.203: LED_HEADING.7 75.99,74 87.97,74 88.77,74.8 88.77,76.06 90.84,78.13 RN1.16
N$203  (via drill 0.38)
  Top 0.203: RN1.8 92.32,82.3 92.84,82.3 93.6,83.06 95.17,83.06 96.01,82.22 v96.01,82.17 | v99.02,81.92 99.05,81.89 IC8.15
  Bottom 0.203: v96.01,82.17 96.27,81.92 v99.02,81.92
N$204
  Top 0.203: RN1.7 92.31,81.79 93.05,81.79 93.8,82.54 IC8.1
N$205
  Top 0.203: RN1.6 93.1,81.27 93.72,81.89 IC8.2
N$206
  Top 0.203: RN1.5 92.34,80.81 93.3,80.81 93.72,81.24 IC8.3
N$207
  Top 0.203: RN1.4 93.44,80.27 93.71,80.55 94.44,80.55 IC8.4
N$208
  Top 0.203: IC8.5 94.31,79.77 RN1.3
N$209
  Top 0.203: RN1.2 94.46,79.27 IC8.6
N$210
  Top 0.203: RN1.1 94.36,78.77 IC8.7
N$211
  Top 0.508: R12.2 95.54,85.05 98.17,82.42 98.17,80.03 99.55,78.66 100.32,78.66 IC8.10 99.34,78.64 97.24,76.54 C8.1
N$241  (via drill 0.38)
  Top 0.203: v61.49,50.93 67.18,50.93 | 67.18,50.93 67.18,51.94 79.17,63.93 80.29,63.93 81.3,64.95 81.3,66.37 90.04,75.11 LED_HEADING.1 | 67.18,50.93 Q1.3
  Bottom 0.203: LED_PITCH.1 48.51,69.22 50.67,67.06 50.67,64.52 49.4,63.25 49.4,55.88 LED_ROLL.1 48.51,50.93 | 48.51,50.93 48.51,38.86 51.31,36.07 51.31,34.29 49.53,32.51 49.53,26.42 LED_POWER.1 | LED_HEADING.1 90.04,70.48 93.09,67.44 93.09,63.25 91.31,61.47 91.31,56.13 LED_DEPTH.1 | 48.51,50.93 v61.49,50.93
N$242  (via drill 0.38)
  Top 0.203: v75.41,52.96 73.48,51.03 Q2.3 | v61.49,64.75 v63.83,62.41
  Bottom 0.203: LED_POWER.2 48.2,27.62 48.2,29.5 47.37,30.32 47.37,36.32 45.97,37.72 LED_ROLL.2 45.97,56.16 47.94,58.13 47.94,58.71 47.03,59.62 47.03,65.59 45.97,66.65 LED_PITCH.2 46.05,75.21 47.17,76.33 49.4,76.33 60.98,64.75 v61.49,64.75 | LED_HEADING.2 88.65,74.04 88.65,60.52 89.72,59.44 89.72,57.98 87.5,55.75 LED_DEPTH.2 87.5,54.79 85.67,52.96 v75.41,52.96 72.67,52.96 63.83,61.8 v63.83,62.41
N$243
  Top 0.203: Q3.3 67.69,37.72 71.14,41.17 71.14,55.3 71.86,56.01 76.22,56.01 77.34,54.89 LED_DEPTH.6 | LED_HEADING.6 77.34,75.21 76.33,75.21 63.8,87.73 41.71,87.73 39.45,85.47 39.45,78.77 35.89,75.21 LED_PITCH.6
  Bottom 0.203: LED_PITCH.6 35.81,67.82 34.75,66.76 34.75,58.21 35.81,57.15 LED_ROLL.6 35.81,49.66 34.8,48.64 34.8,26.67 LED_POWER.6 | LED_HEADING.6 77.34,71.88 76.12,70.66 76.12,56.09 LED_DEPTH.6
N$244
  Top 0.203: LED_DEPTH.8 72.26,50.52 72.87,49.91 73.08,49.91 73.38,49.61 73.38,42.9 73.89,42.39 73.89,36.6 Q4.3
  Bottom 0.203: LED_DEPTH.8 70.36,56.77 70.36,68.83 72.26,70.74 LED_HEADING.8 70.23,77.22 45.69,77.22 44.74,78.17 32.45,78.17 30.73,76.45 LED_PITCH.8 30.73,72.26 32.05,70.95 32.05,56.56 30.73,55.25 LED_ROLL.8 32,53.72 32,26.67 LED_POWER.8
N$245
  Top 0.203: LED_DEPTH.14 86.23,66.29 90.8,66.29 91.82,65.28 91.82,62.93 RN2.9
N$246
  Top 0.203: LED_DEPTH.16 89.15,64.14 89.03,64.14 89.03,62.58 90.28,61.32 RN2.10
N$247
  Top 0.203: LED_DEPTH.13 82.42,64.77 84.33,62.87 86.23,62.87 88.28,60.82 RN2.11
N$248
  Top 0.203: LED_DEPTH.3 84.96,58.04 87.25,60.32 RN2.12
N$249  (via drill 0.38)
  Top 0.203: v86.74,57.91 86.74,58.83 86.73,58.84 86.73,59.17 87.39,59.83 87.97,59.83 87.98,59.82 RN2.13
  Bottom 0.203: LED_DEPTH.5 81.53,56.52 85.34,56.52 v86.74,57.91
N$250  (via drill 0.38)
  Top 0.203: v87.68,59.13 87.94,59.4 90.64,59.4 RN2.14
  Bottom 0.203: LED_DEPTH.11 77.34,62.1 80.52,58.93 87.47,58.93 v87.68,59.13
N$251  (via drill 0.38)
  Top 0.203: RN2.15 90.64,58.75 88.94,58.75 v88.85,58.65
  Bottom 0.203: LED_DEPTH.15 87.5,61.09 88.39,60.2 88.39,59.11 v88.85,58.65
N$252
  Top 0.203: RN2.16 90.72,57.57 88.77,55.63 88.77,54.36 87.88,53.47 75.95,53.47 74.8,54.61 LED_DEPTH.7
N$253  (via drill 0.38)
  Top 0.203: RN2.8 92.52,61.82 93.53,62.83 95.21,62.83 96.14,61.9 v96.14,61.85 | IC10.15 100.24,61.79 99.69,61.79 99.62,61.85 v98.81,61.85
  Bottom 0.203: v98.81,61.85 v96.14,61.85
N$254
  Top 0.203: RN2.7 92.19,61.34 92.62,61.34 93.62,62.35 IC10.1
N$255
  Top 0.203: RN2.6 92.19,60.84 92.69,60.84 93.55,61.7 IC10.2
N$256
  Top 0.203: RN2.5 92.19,60.34 92.77,60.34 93.47,61.05 IC10.3
N$257
  Top 0.203: RN2.4 92.19,59.84 92.84,59.84 93.39,60.4 IC10.4
N$258
  Top 0.203: RN2.3 92.19,59.34 93.17,59.34 93.57,59.75 IC10.5
N$259
  Top 0.203: RN2.2 93.65,58.82 93.76,58.93 94.31,58.93 IC10.6
N$260
  Top 0.203: RN2.1 93.73,58.32 93.86,58.45 IC10.7
N$261
  Top 0.508: R14.2 95.54,64.86 97.92,62.48 97.92,59.46 98.93,58.45 IC10.10 99.15,58.45 99.15,56.13 C10.1
OE  (via drill 0.38)
  Top 0.203: v60.68,30.91 58.95,30.91 IC6.13 | v79.35,21.34 79.48,21.46 84.52,21.46 U1.10 | v99.08,60.78 99.39,60.48 100.3,60.48 IC10.13 | v99.08,80.39 99.49,80.39 99.59,80.49 100.3,80.49 IC8.13 | 62.92,60.48 59.97,60.48 59.77,60.27 58.85,60.27 IC4.13 | 62.92,60.48 64.54,62.1 64.54,73.25 60.78,77.01 v60.78,79.98 | v60.38,81.41 59.46,80.49 58.85,80.49 IC2.13 | v97.26,81.2 97.26,81.92 v92.69,86.49 | 62.92,60.48 v62.92,56.52
  Bottom 0.203: v79.35,21.34 79.22,21.21 74.6,21.21 64.9,30.91 v60.68,30.91 60.68,35.38 59.36,36.7 59.36,41.91 62.92,45.47 v62.92,56.52 | v99.08,60.78 99.08,61.09 99.59,61.59 99.59,79.88 v99.08,80.39 98.07,80.39 v97.26,81.2 | v60.78,79.98 60.78,81 60.73,81.05 | v60.38,81.41 60.73,81.05 | v92.69,86.49 66.17,86.49 60.73,81.05
RCK  (via drill 0.38)
  Top 0.203: v60.17,59.67 58.85,59.67 IC4.12 | 62.38,77.95 62.38,79.4 61.09,80.7 60.27,80.7 59.46,79.88 58.85,79.88 IC2.12 | 62.38,77.95 v62.38,76.43 | v57.73,30.91 58.34,30.3 58.85,30.3 IC6.12 | v102.92,61.72 100.97,59.77 100.41,59.77 IC10.12 | v103.02,78.16 102.84,78.16 101.06,79.94 IC8.12 | v93.4,25.63 93.4,22.17 U1.32 | v95.33,53.04 95.22,52.93 v95.22,27.71 | v62.46,77.95 62.38,77.95
  Bottom 0.203: v62.38,76.43 62.38,62.69 60.17,60.48 v60.17,59.67 62.2,57.63 62.2,45.49 58.95,42.24 58.95,33.05 57.73,31.83 v57.73,30.91 | v95.22,27.71 93.4,25.88 v93.4,25.63 | v95.33,53.04 95.33,54.13 v102.92,61.72 102.95,61.75 102.95,78.16 v103.02,78.16 103.02,81.74 101.83,82.93 95.73,82.93 90.96,78.16 88.92,78.16 86.39,75.62 86.39,75.11 85.37,74.09 79.48,74.09 78.77,74.8 78.77,75.31 76.12,77.95 v62.46,77.95
RESET  (via drill 0.38, 0.64)
  Top 0.203: 94.26,20.09 93.9,19.74 93.4,19.74 U1.29 | 94.26,20.09 94.31,20.14 94.31,25.73 89.18,30.86 75.56,30.86 73.89,29.18 73.89,27.86 72.57,26.54 72.57,22.28 R1.2 72.47,22.17 72.36,22.07 v72.36,21.06 | 94.26,20.09 v94.61,19.74 | v72.44,8.84 73.66,7.62 C18.1
  Bottom 0.203: JP7.5 102.87,18.57 101.7,19.74 v94.61,19.74 | v72.36,21.06 72.81,21.06 74.45,19.41 77.11,19.41 78.74,17.78 78.74,14.54 73.03,8.84 v72.44,8.84
RX  (via drill 0.64)
  Top 0.254: v95.89,14.61 95.8,14.69 v95.8,16.42 | U1.30 93.13,20.31 92.55,20.31 90.8,18.57 v90.8,16.51
  Bottom 0.203: 72.39,2.54 73.03,2.54 74.3,3.81 74.3,7.62 76.2,9.52 79.38,9.52
  Bottom 0.254: JP5.4 65.79,4.06 67.31,2.54 72.39,2.54 | 79.38,9.52 86.36,9.52 91.44,14.61 v95.89,14.61 | v95.8,16.42 90.89,16.42 v90.8,16.51
SCK  (via drill 0.38)
  Top 0.203: 101.54,59.25 106.73,64.44 106.73,73.46 100.91,79.27 100.41,79.27 IC8.11 | IC10.11 100.41,59.16 101.32,59.16 101.47,59.31 101.54,59.25 | 61.54,30.76 61.59,30.81 61.59,49.81 59.77,51.64 59.77,54.03 | 61.54,30.76 60.48,29.69 58.95,29.69 IC6.11 | 59.77,58.65 59.77,54.03 | 59.77,58.65 59.46,58.95 58.85,58.95 IC4.11 | v59.36,63.53 59.97,63.53 60.78,64.34 60.78,76.28 60.38,76.68 60.38,78.16 59.36,79.17 58.85,79.17 IC2.11 | 59.77,58.65 v60.07,58.65 | v64.24,30.2 62.1,30.2 61.54,30.76 | U1.17 86.18,14.96 85.17,14.96 85.06,14.86 84.45,14.86 82.58,16.74 v82.58,16.69 | v101.62,59.16 101.54,59.25 | 59.77,54.03 v68.15,54.03
  Bottom 0.203: v59.36,63.53 59.36,59.36 v60.07,58.65 | v64.24,30.2 74.62,19.82 78.88,19.82 82.01,16.69 v82.58,16.69 | v101.62,59.16 101.62,55.14 98.73,52.25 69.67,52.25 68.15,53.77 v68.15,54.03
  Bottom 0.254: JP7.3 101.42,16.2 101.42,17.75 100.69,18.48 94.66,18.48 91.16,21.98 87.71,21.98 86.27,20.54 86.27,20.38 v82.58,16.69
SCL
  Top 0.203: U1.28 93.4,18.92 94.82,18.92 95.33,19.43 95.33,26.54 90.14,31.72 90.14,43.51 88.82,44.83 M2.SCL
SDA  (via drill 0.38)
  Top 0.203: v96.72,36.83 96.72,20.22 94.61,18.11 93.4,18.11 U1.27 | v88.9,42.32 82.19,42.32 M2.SDA
  Bottom 0.203: v88.9,42.32 91.24,42.32 v96.72,36.83
SERVO_1  (via drill 0.64)
  Top 0.406: v75.56,18.41 76.05,18.9 U1.13
  Bottom 0.406: JP2.3 26.67,86.36 28.57,84.45 28.57,25.4 35.56,18.41 v75.56,18.41
SERVO_2  (via drill 0.64)
  Top 0.406: U1.14 77.16,18.1 v76.2,17.14 | v11.43,50.8 11.43,61.59 9.53,63.5 JP3.3
  Bottom 0.406: v76.2,17.14 61.86,17.14 61.57,17.44 34,17.44 25.56,25.87 25.56,36.59 11.43,50.73 v11.43,50.8
SERVO_3  (via drill 0.64)
  Top 0.381: v86.18,17.2 86.08,17.3 85.09,17.3 84.76,17.3 U1.15 | JP4.3 9.53,48.9 v9.53,40.64
  Top 0.406: 85.09,17.3 83.1,17.3 82.91,17.49 78.45,17.49 v76.83,15.88
  Bottom 0.381: v9.53,40.64 10.13,40.03 21.28,40.03 24.97,36.34 24.97,25.2 35.71,14.45 38.35,14.45 39.14,15.24 56.52,15.24
  Bottom 0.406: 56.52,15.24 59.01,15.24 60.58,16.8 61.34,16.8 62.27,15.88 v76.83,15.88
  Bottom 0.635: v86.18,17.2 86.18,17.35 86.66,17.83 95.86,17.83 98.93,14.76 JP7.4
TX  (via drill 0.38)
  Top 0.203: v90.86,21.26 93.29,21.26 U1.31
  Bottom 0.203: v90.86,21.26 89.03,21.26 84.05,16.28 84.05,14.25 | 77.47,10.8 75.56,10.8 73.03,8.25 73.03,4.45 72.01,3.43 70.1,3.43
  Bottom 0.254: 84.05,14.25 80.59,10.8 77.47,10.8 | JP5.5 68.33,4.06 68.96,3.43 70.1,3.43
X_AXIS
  Top 0.203: U1.24 92,14.83 92,13.51 96.67,8.84 96.67,4.82 97.53,3.96 99.24,3.96 100.46,5.18 JP6.1
Y_AXIS
  Top 0.203: U1.25 93.52,16.45 93.52,14.2 97.89,9.83 97.89,5.89 JP6.2
Z_AXIS
  Top 0.203: U1.26 93.95,17.3 94.59,16.67 94.59,14.33 101.55,7.37 101.55,4.57 100.53,3.56 97.28,3.56 95.45,5.39 95.45,5.79 JP6.3

### Text on the board
tPlace: S1 | P / 7 / G | P / 7 / G | S2 | P / 7 / G | S3 | DEP | 5V | GND | GND | 5V | BUT | Z | Y | X
bPlace: PITCH | HEADING | DEPTH | ROLL | POWER | D.Y.
tNames: GND | 5V | TX | RX | DTR